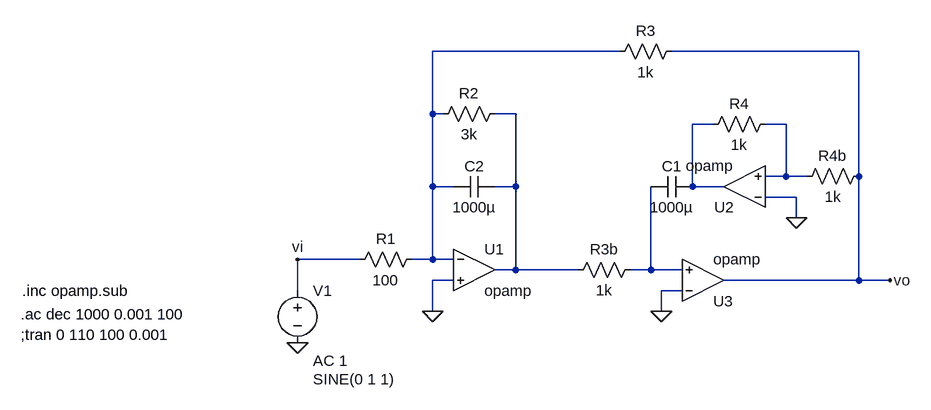
[diagram p0: schematic TPS2.asc]
TPS2.asc, the LTspice schematic file:
Version 4
SHEET 1 880 680
WIRE 224 -80 -64 -80
WIRE 592 -80 304 -80
WIRE -64 16 -64 -80
WIRE -48 16 -64 16
WIRE 64 16 32 16
WIRE 368 32 336 32
WIRE 480 32 448 32
WIRE 480 112 480 32
WIRE 480 112 448 112
WIRE 512 112 480 112
WIRE 592 112 592 -80
WIRE -64 128 -64 16
WIRE -32 128 -64 128
WIRE 64 128 64 16
WIRE 64 128 32 128
WIRE 336 128 336 32
WIRE 384 128 336 128
WIRE 496 144 448 144
WIRE 496 176 496 144
WIRE -176 240 -272 240
WIRE -64 240 -64 128
WIRE -64 240 -96 240
WIRE -32 240 -64 240
WIRE 64 256 64 128
WIRE 64 256 32 256
WIRE 160 256 64 256
WIRE 272 256 272 128
WIRE 272 256 240 256
WIRE 320 256 272 256
WIRE -32 272 -64 272
WIRE 592 272 592 112
WIRE 592 272 384 272
WIRE 640 272 592 272
WIRE -272 288 -272 240
WIRE 320 288 288 288
WIRE -64 320 -64 272
WIRE 288 320 288 288
FLAG -272 368 0
FLAG -64 320 0
FLAG 496 176 0
FLAG 288 320 0
FLAG -272 240 vi
FLAG 640 272 vo
SYMBOL res 48 0 R90
WINDOW 0 0 56 VBottom 2
WINDOW 3 32 56 VTop 2
SYMATTR InstName R2
SYMATTR Value 3k
SYMBOL res -80 224 R90
WINDOW 0 0 56 VBottom 2
WINDOW 3 32 56 VTop 2
SYMATTR InstName R1
SYMATTR Value 100
SYMBOL res 256 240 R90
WINDOW 0 0 56 VBottom 2
WINDOW 3 32 56 VTop 2
SYMATTR InstName R3b
SYMATTR Value 1k
SYMBOL res 320 -96 R90
WINDOW 0 0 56 VBottom 2
WINDOW 3 32 56 VTop 2
SYMATTR InstName R3
SYMATTR Value 1k
SYMBOL res 464 16 R90
WINDOW 0 0 56 VBottom 2
WINDOW 3 32 56 VTop 2
SYMATTR InstName R4
SYMATTR Value 1k
SYMBOL res 608 96 R90
WINDOW 0 0 56 VBottom 2
WINDOW 3 32 56 VTop 2
SYMATTR InstName R4b
SYMATTR Value 1k
SYMBOL voltage -272 272 R0
WINDOW 3 24 152 Left 2
WINDOW 123 24 124 Left 2
WINDOW 39 0 0 Left 0
SYMATTR InstName V1
SYMATTR Value SINE(0 1 1)
SYMATTR Value2 AC 1
SYMBOL OpAmps\\opamp 0 192 R0
SYMATTR InstName U1
SYMBOL OpAmps\\opamp 416 192 R180
SYMATTR InstName U2
SYMBOL OpAmps\\opamp 352 336 M180
SYMATTR InstName U3
SYMBOL cap 336 112 R90
WINDOW 0 0 32 VBottom 2
WINDOW 3 32 32 VTop 2
SYMATTR InstName C1
SYMATTR Value 1000µ
SYMBOL cap 32 112 R90
WINDOW 0 0 32 VBottom 2
WINDOW 3 32 32 VTop 2
SYMATTR InstName C2
SYMATTR Value 1000µ
TEXT -696 288 Left 2 !.inc opamp.sub
TEXT -698 324 Left 2 !.ac dec 1000 0.001 100
TEXT -698 356 Left 2 !;tran 0 110 100 0.001

The netlist it stands for:
* TPS2.asc
R2 N002 N001 3k
R1 N001 vi 100
R3b N005 N002 1k
R3 vo N001 1k
R4 N004 N003 1k
R4b vo N004 1k
V1 vi 0 SINE(0 1 1) AC 1
XU1 N001 0 N002 opamp Aol=100K GBW=10Meg  ; pins invin noninvin out
XU2 0 N004 N003 opamp Aol=100K GBW=10Meg  ; pins invin noninvin out
XU3 0 N005 vo opamp Aol=100K GBW=10Meg  ; pins invin noninvin out
C1 N003 N005 1000µ
C2 N002 N001 1000µ
.inc opamp.sub
.ac dec 1000 0.001 100
;tran 0 110 100 0.001
.backanno
.end